# Altium schematic sheet Power_Supply.SchDoc
size A1
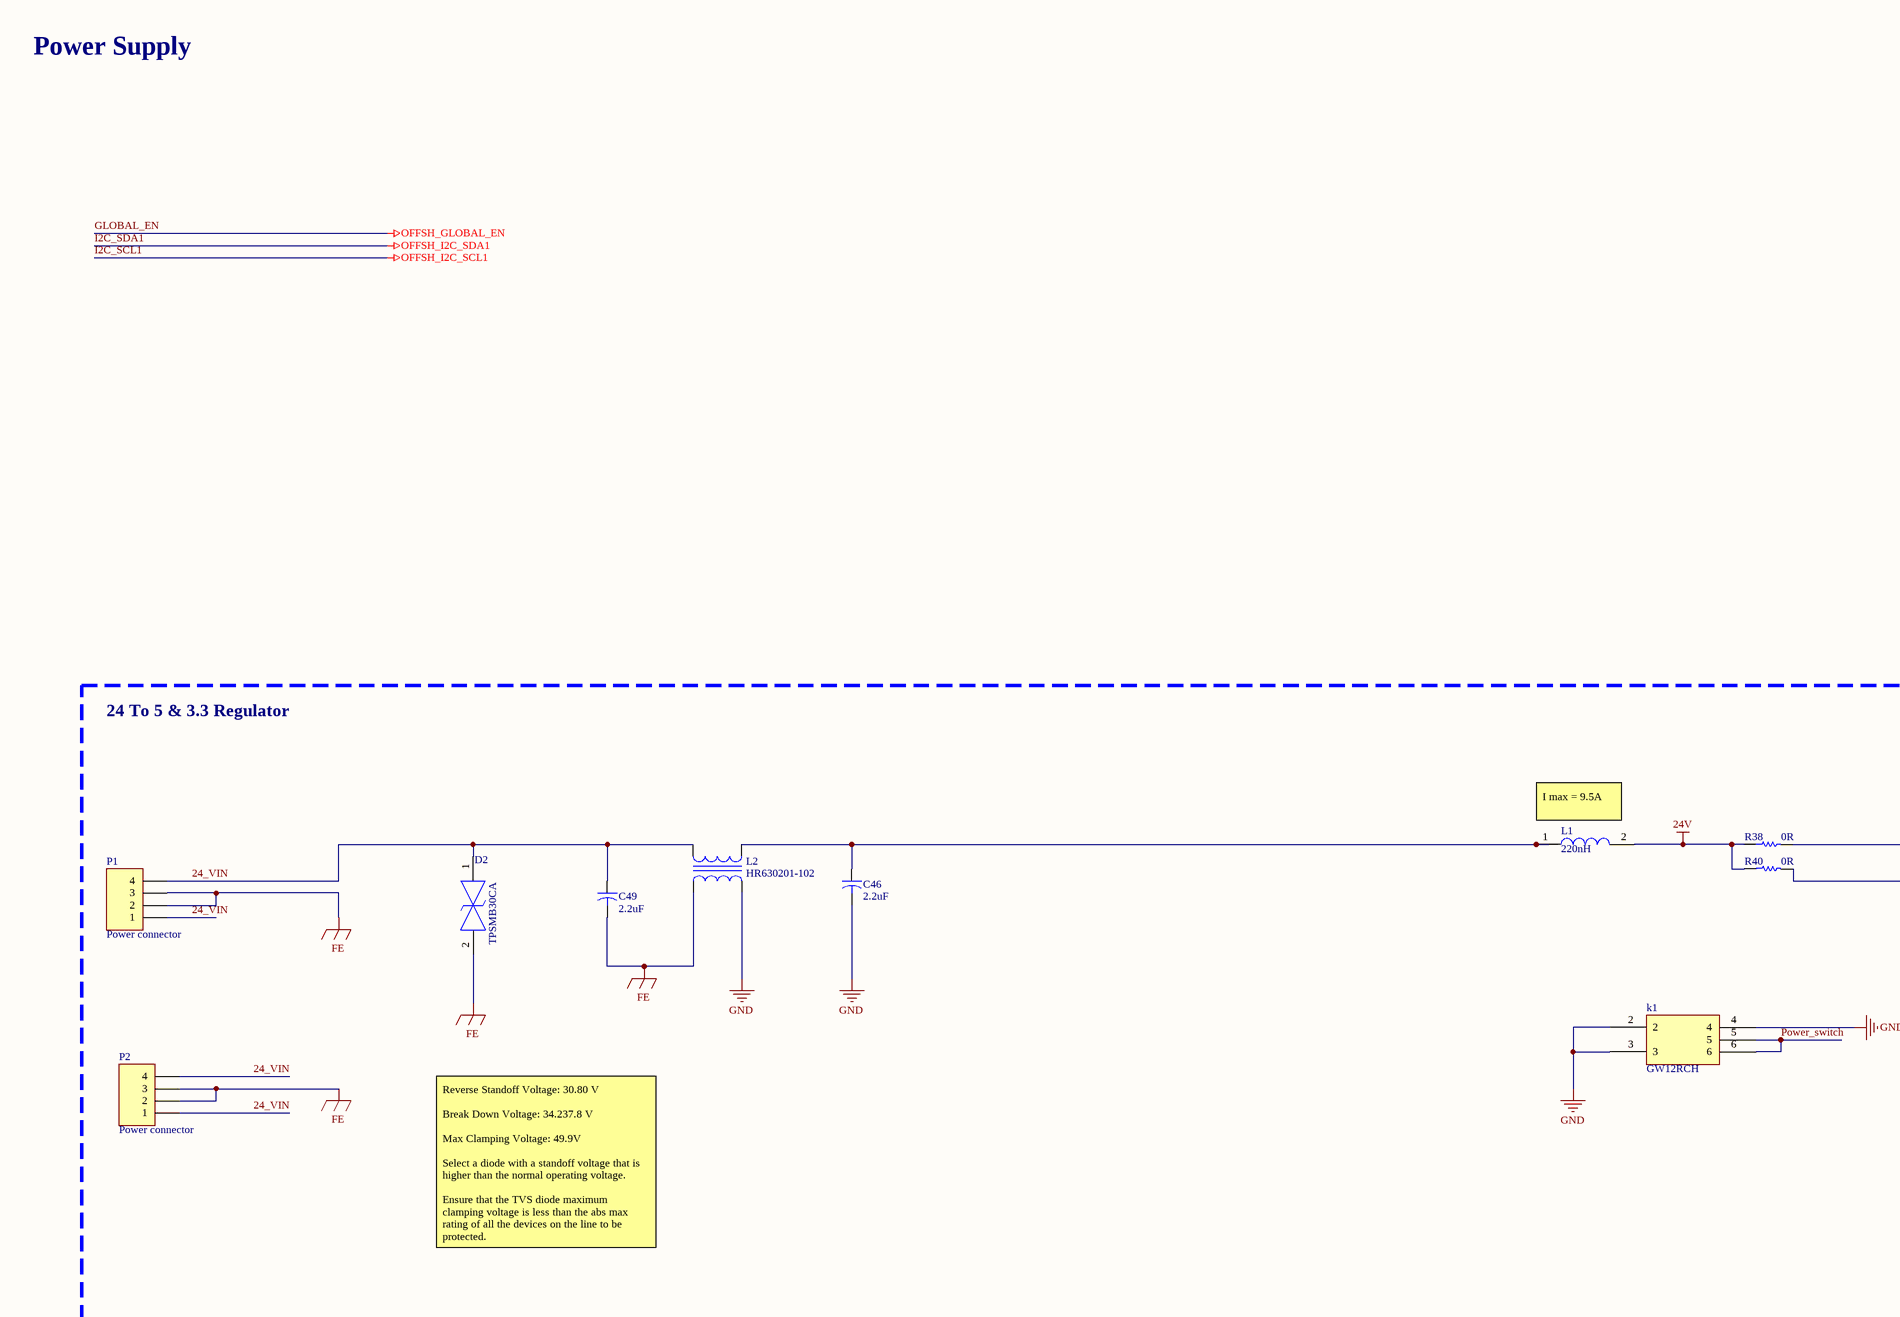
[diagram p0: Power_Supply.SchDoc, top left]
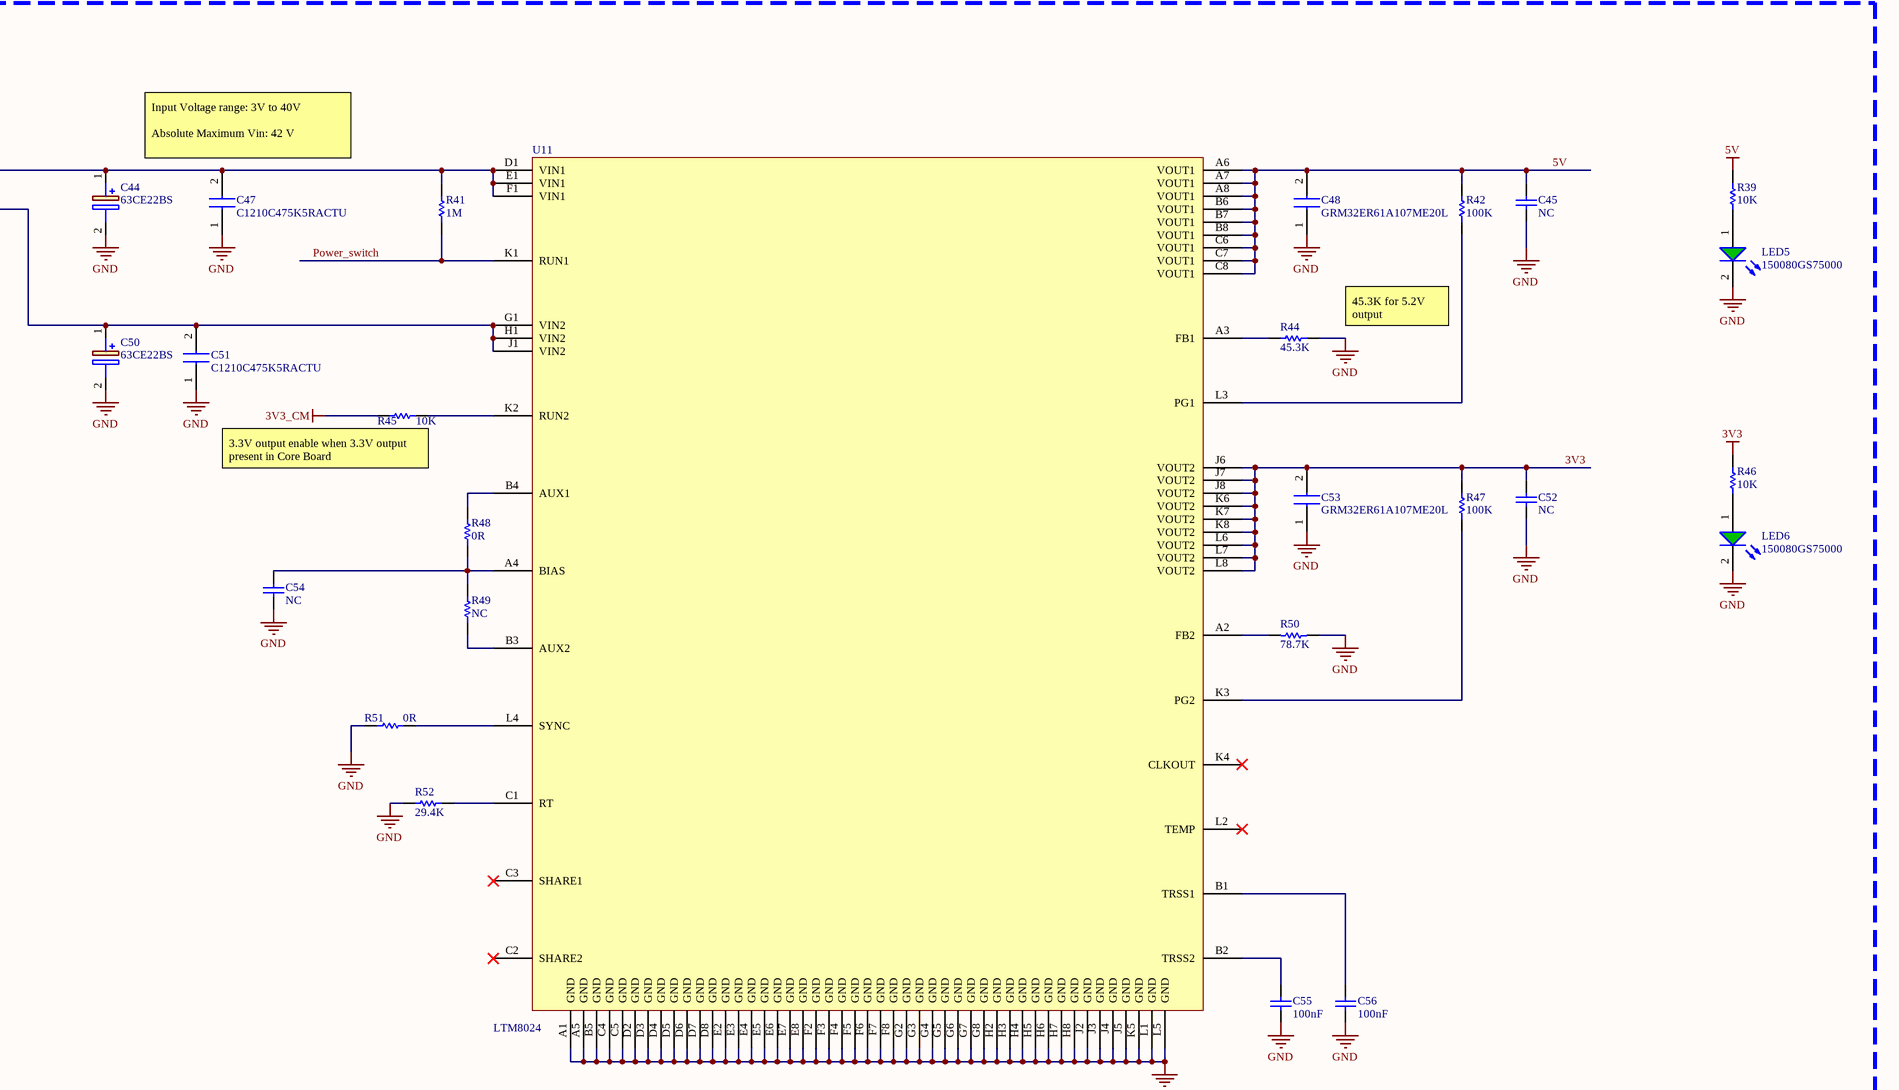
[diagram p1: Power_Supply.SchDoc, top right]
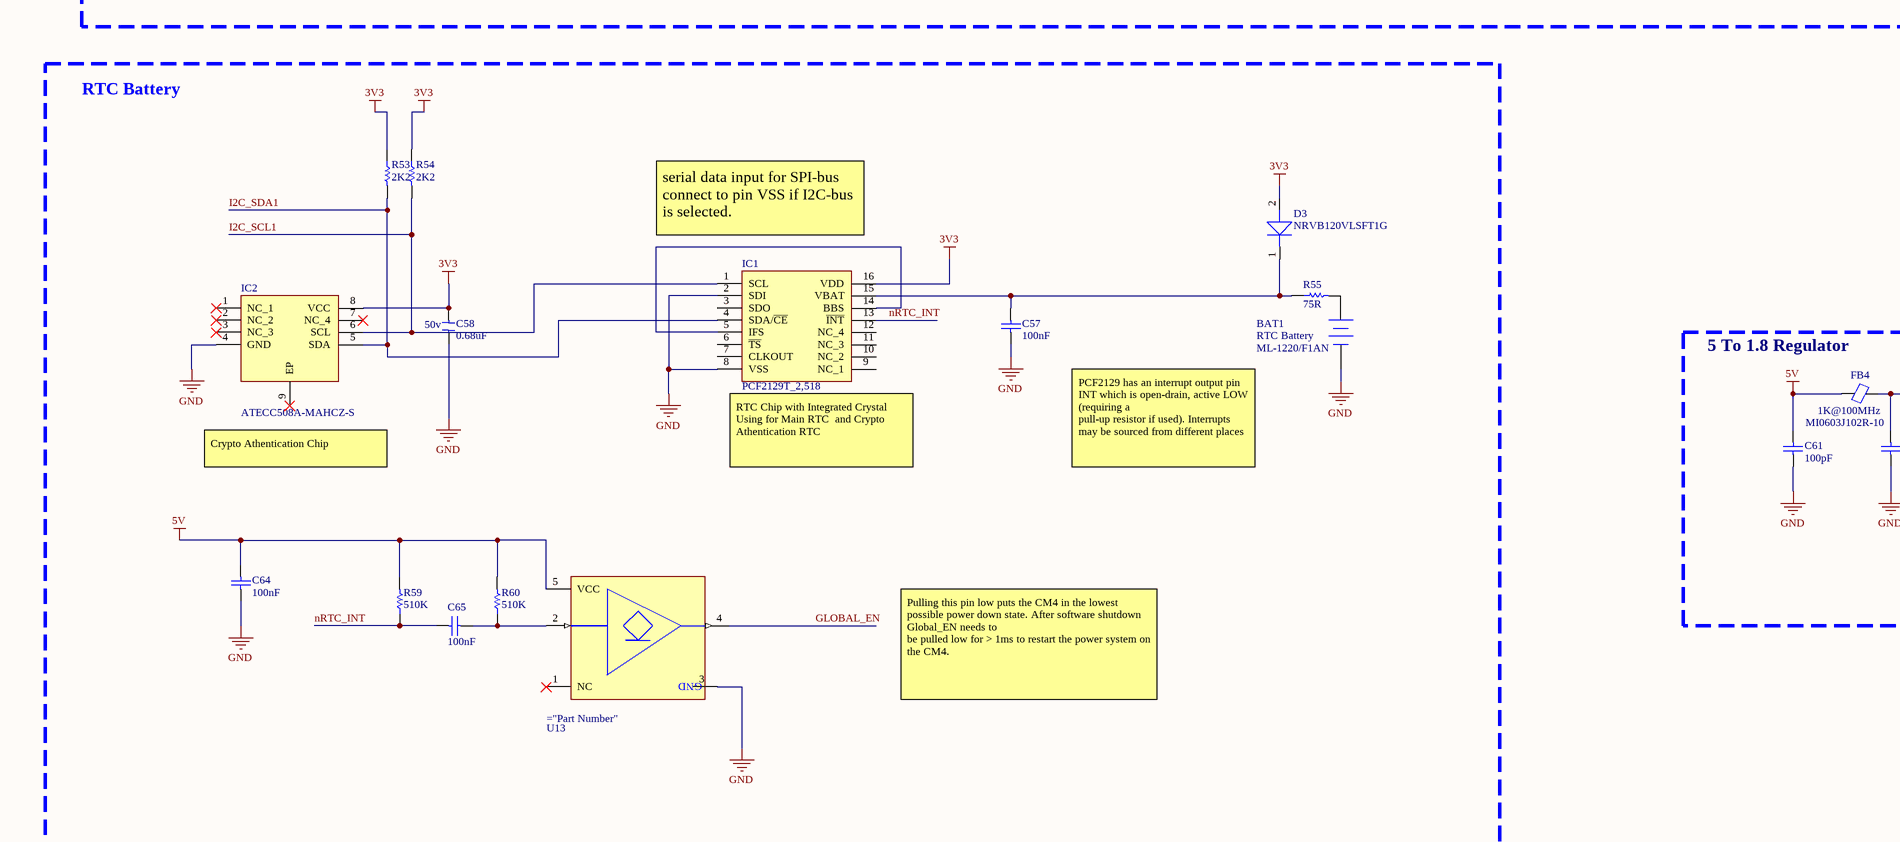
[diagram p2: Power_Supply.SchDoc, bottom left]
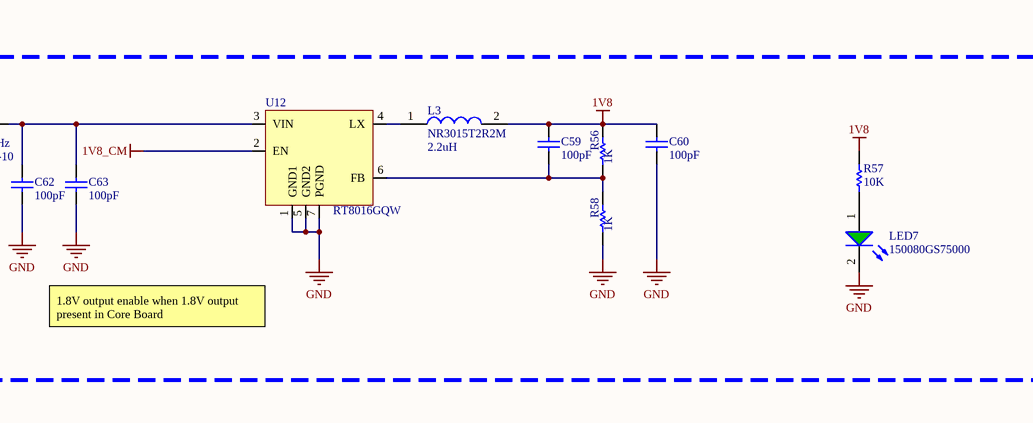
[diagram p3: Power_Supply.SchDoc, bottom right]

## Parts
BAT1  RTC Battery  Part Number: ML-1220/F1AN  [ML-1220F1AN]
C44  63CE22BS  [63CE22BS]
C45  value NC  [CAP (0603)]  (hidden comment: Cap)
C46  value 2.2uF  [TANTAL (SIZE B)]  (hidden comment: Cap_Tantal)
C47  C1210C475K5RACTU  [CAPC3225X280N]
C48  GRM32ER61A107ME20L  [CAPC3225X270N]
C49  value 2.2uF  [TANTAL (SIZE B)]  (hidden comment: Cap_Tantal)
C50  63CE22BS  [63CE22BS]
C51  C1210C475K5RACTU  [CAPC3225X280N]
C52  value NC  [CAP (0603)]  (hidden comment: Cap)
C53  GRM32ER61A107ME20L  [CAPC3225X270N]
C54  value NC  [CAP (0603)]  (hidden comment: Cap)
C55  value 100nF  [CAP (0603)]  (hidden comment: Cap)
C56  value 100nF  [CAP (0603)]  (hidden comment: Cap)
C57  value 100nF  [CAP (0603)]  (hidden comment: Cap)
C58  value 0.68uF  Voltage: 50v  [0603 Capacitor]  (hidden comment: Capacitor SMD)
C59  value 100pF  [CAP (0603)]  (hidden comment: Cap)
C60  value 100pF  [CAP (0603)]  (hidden comment: Cap)
C61  value 100pF  [CAP (0603)]  (hidden comment: Cap)
C62  value 100pF  [CAP (0603)]  (hidden comment: Cap)
C63  value 100pF  [CAP (0603)]  (hidden comment: Cap)
C64  value 100nF  [CAP (0603)]  (hidden comment: Cap)
C65  value 100nF  [CAP (0603)]  (hidden comment: Cap)
D2  TPSMB30CA  [DIONM5444X261N]
D3  Schottky Diode  [SODFL3616X98N (SOD-123FL)]  (value not drawn)
FB4  value 1K@100MHz  Part Number: MI0603J102R-10  [FB0603]  (hidden comment: Ferrite Bead)
IC1  PCF2129T_2,518  [SOIC127P1032X265-16N]
IC2  ATECC508A-MAHCZ-S  [DFN200X300X60-9N]
k1  GW12RCH  [PCBComponent_1]
L1  220nH  [WE-LHMI_402048]
L2  HR630201-102  [PCBComponent_1 - duplicate]
L3  value 2.2uH  [NR3015T2R2M]  (hidden comment: Inductor)
LED5  150080GS75000  [LED_0805_Green]
LED6  150080GS75000  [LED_0805_Green]
LED7  150080GS75000  [LED_0805_Green]
P1  Power connector  [XH_4Pin]
P2  Power connector  [XH_4Pin]
R38  value 0R  [RES (0603)]  (hidden comment: Res)
R39  value 10K  [R0603]  (hidden comment: Res)
R40  value 0R  [RES (0603)]  (hidden comment: Res)
R41  value 1M  [RES 0603]  (hidden comment: Res)
R42  value 100K  [RES (0603)]  (hidden comment: Res)
R44  value 45.3K  [RES (0603)]  (hidden comment: Res)
R45  value 10K  [RES (0603)]  (hidden comment: Res)
R46  value 10K  [R0603]  (hidden comment: Res)
R47  value 100K  [RES (0603)]  (hidden comment: Res)
R48  value 0R  [RES (0603)]  (hidden comment: Res)
R49  value NC  [RES (0603)]  (hidden comment: Res)
R50  value 78.7K  [RES (0603)]  (hidden comment: Res)
R51  value 0R  [RES (0603)]  (hidden comment: Res)
R52  value 29.4K  [RES (0603)]  (hidden comment: Res)
R53  value 2K2  [RES 0603]  (hidden comment: Res)
R54  value 2K2  [RES 0603]  (hidden comment: Res)
R55  value 75R  [RES (0603)]  (hidden comment: Res)
R56  value 1K  [R0603]  (hidden comment: Res)
R57  value 10K  [R0603]  (hidden comment: Res)
R58  value 1K  [R0603]  (hidden comment: Res)
R59  value 510K  [RES (0603)]  (hidden comment: Res)
R60  value 510K  [RES (0603)]  (hidden comment: Res)
U11  LTM8024  [BGA88C100P8X11_900X1125X352]
U12  RT8016GQW  [SON65P200X200X80-7N (WDFN-6L)]
U13  74LVC1G07SE-7  [SOT65P210X110-5N]  (value not drawn)

## Nets
1V8: C59.1 C60.1 L3.2 R56.2 R57.1
1V8_CM: U12.2(EN)
3V3: C52.1 C53.2 C58.2 D3.2(A) IC1.16(VDD) IC2.8(VCC) R46.1 R47.2 R53.1 R54.1 U11.J6(VOUT2) U11.J7(VOUT2) U11.J8(VOUT2) U11.K6(VOUT2) U11.K7(VOUT2) U11.K8(VOUT2) U11.L6(VOUT2) U11.L7(VOUT2) U11.L8(VOUT2)
3V3_CM: R45.2
5V: C45.1 C48.2 C61.1 C64.1 FB4.1 R39.1 R42.2 R59.2 R60.2 U11.A6(VOUT1) U11.A7(VOUT1) U11.A8(VOUT1) U11.B6(VOUT1) U11.B7(VOUT1) U11.B8(VOUT1) U11.C6(VOUT1) U11.C7(VOUT1) U11.C8(VOUT1) U13.5(VCC)
24V: L1.2 R38.1 R40.1
FE: C49.2 D2.2 L2.4 P1.2 P1.3 P2.2 P2.3
GLOBAL_EN: U13.4(Y)  [also labelled OFFSH_GLOBAL_EN]
GND: BAT1.2(-) C44.2(-) C45.2 C46.2 C47.1 C48.1 C50.2(-) C51.1 C52.2 C53.1 C54.1 C55.1 C56.1 C57.2 C58.1 C60.2 C61.2 C62.2 C63.2 C64.2 IC1.2(SDI) IC1.8(VSS) IC2.4(GND) k1.2 k1.3 k1.4 L2.2 LED5.2(C) LED6.2(C) LED7.2(C) R44.1 R50.1 R51.1 R52.2 R58.1 U11.A1(GND) U11.A5(GND) U11.B5(GND) U11.C4(GND) U11.C5(GND) U11.D2(GND) U11.D3(GND) U11.D4(GND) U11.D5(GND) U11.D6(GND) U11.D7(GND) U11.D8(GND) U11.E2(GND) U11.E3(GND) U11.E4(GND) U11.E5(GND) U11.E6(GND) U11.E7(GND) U11.E8(GND) U11.F2(GND) U11.F3(GND) U11.F4(GND) U11.F5(GND) U11.F6(GND) U11.F7(GND) U11.F8(GND) U11.G2(GND) U11.G3(GND) U11.G4(GND) U11.G5(GND) U11.G6(GND) U11.G7(GND) U11.G8(GND) U11.H2(GND) U11.H3(GND) U11.H4(GND) U11.H5(GND) U11.H6(GND) U11.H7(GND) U11.H8(GND) U11.J2(GND) U11.J3(GND) U11.J4(GND) U11.J5(GND) U11.K5(GND) U11.L1(GND) U11.L5(GND) U12.1(GND1) U12.5(GND2) U12.7(PGND)
I2C_SCL1: IC1.1(SCL) IC2.6(SCL) R54.2  [also labelled OFFSH_I2C_SCL1]
I2C_SDA1: IC1.4(SDA/~{CE}) IC2.5(SDA) R53.2  [also labelled OFFSH_I2C_SDA1]
24_VIN: C49.1 D2.1 L2.3 P1.1 P1.4 P2.1 P2.4
nRTC_INT: C65.2 IC1.13(~{INT}) R59.1
Power_switch: k1.5 k1.6 R41.1 U11.K1(RUN1)
NetBAT1_1: BAT1.1(+) R55.2
NetC44_1: C44.1(+) C47.2 R38.2 R41.2 U11.D1(VIN1) U11.E1(VIN1) U11.F1(VIN1)
NetC46_1: C46.1 L1.1 L2.1
NetC50_1: C50.1(+) C51.2 R40.2 U11.G1(VIN2) U11.H1(VIN2) U11.J1(VIN2)
NetC54_2: C54.2 R48.1 R49.2 U11.A4(BIAS)
NetC55_2: C55.2 U11.B2(TRSS2)
NetC56_2: C56.2 U11.B1(TRSS1)
NetC57_1: C57.1 D3.1(K) IC1.15(VBAT) R55.1
NetC59_2: C59.2 R56.1 R58.2 U12.6(FB)
NetC62_1: C62.1 C63.1 FB4.2 U12.3(VIN)
NetC65_1: C65.1 R60.1 U13.2(A)
NetIC1_5: IC1.5(IFS) IC1.14(BBS)
NetL3_1: L3.1 U12.4(LX)
NetLED5_1: LED5.1(A) R39.2
NetLED6_1: LED6.1(A) R46.2
NetLED7_1: LED7.1(A) R57.2
NetR42_1: R42.1 U11.L3(PG1)
NetR44_2: R44.2 U11.A3(FB1)
NetR45_1: R45.1 U11.K2(RUN2)
NetR47_1: R47.1 U11.K3(PG2)
NetR48_2: R48.2 U11.B4(AUX1)
NetR49_1: R49.1 U11.B3(AUX2)
NetR50_2: R50.2 U11.A2(FB2)
NetR51_2: R51.2 U11.L4(SYNC)
NetR52_1: R52.1 U11.C1(RT)

Not connected (* = marked no-connect by the designer): IC1 3(SDO) 6(~{TS}) 7(CLKOUT) 9(NC_1) 10(NC_2) 11(NC_3) 12(NC_4); IC2 1(NC_1)* 2(NC_2)* 3(NC_3)* 7(NC_4)* 9(EP)*; U11 C2(SHARE2)* C3(SHARE1)* K4(CLKOUT)* L2(TEMP)*; U13 1(NC)* 3(GND)

## Notes on the sheet
- Power Supply
- 24 To 5 & 3.3 Regulator
- (near L1) I max = 9.5A
- Input Voltage range: 3V to 40V
  Absolute Maximum Vin: 42 V
- (near R44) 45.3K for 5.2V output
- (near R45) 3.3V output enable when 3.3V output present in Core Board
- Reverse Standoff Voltage: 30.80 V
  Break Down Voltage: 34.237.8 V
  Max Clamping Voltage: 49.9V
  Select a diode with a standoff voltage that is higher than the normal operating voltage.
  Ensure that the TVS diode maximum clamping voltage is less than the abs max rating of all the devices on the line to be protected.
- RTC Battery
- serial data input for SPI-bus
  connect to pin VSS if I2C-bus is selected.
- (near FB4) 5 To 1.8 Regulator
- Crypto Athentication Chip
- (near IC1) RTC Chip with Integrated Crystal
  Using for Main RTC  and Crypto Athentication RTC
- PCF2129 has an interrupt output pin INT which is open-drain, active LOW (requiring a
  pull-up resistor if used). Interrupts may be sourced from different places
- 1.8V output enable when 1.8V output present in Core Board
- Pulling this pin low puts the CM4 in the lowest possible power down state. After software shutdown Global_EN needs to
  be pulled low for > 1ms to restart the power system on the CM4.

## Library data of the parts
BAT1 = RTC BAT (ML-1220_F1AN): Manufacturer_Name: Panasonic Battery; Datasheet Link: http://media.digikey.com/pdf/Data%20Sheets/Panasonic%20Inustrial/ML_Serie.pdf; Link: https://www.digikey.com/product-detail/en/panasonic-bsg/ML-1220-F1AN/P295-ND/447504
C44 C50 = 63CE22BS: Capacitor Polarised; Manufacturer_Name: Suncon; Value: 22uF; Datasheet Link: http://www.sunelec.co.jp/common/pdf/eng/CE-BS.pdf; Height: 8mm; Manufacturer_Part_Number: 63CE22BS; Arrow Part Number: 63CE22BS
C45 C52 C54 = Cap: SMD capacitor; Part Number: SMD CAP (0603)
C46 C49 = Cap_Tantal: Tantalum Capacitor; Voltage: 10V
C47 C51 = C1210C475K5RACTU: Capacitor, 4.7uF, 50V; Manufacturer_Name: Kemet; Datasheet Link: https://componentsearchengine.com/Datasheets/2/C1210C475K5RACTU.pdf; Height: 2.8mm; Manufacturer_Part_Number: C1210C475K5RACTU; Arrow Part Number: C1210C475K5RACTU; Arrow Price/Stock: https://www.arrow.com/en/products/c1210c475k5ractu/kemet-corporation; Mouser Part Number: 80-C1210C475K5R; Mouser Price/Stock: https://www.mouser.co.uk/ProductDetail/KEMET/C1210C475K5RACTU?qs=dB0LedT%252BmmBpncka1nOCUg%3D%3D; Value: 4.7uF; Voltage: 50V; Package: 1210
C48 C53 = GRM32ER61A107ME20L: Capacitor, 100uF, 10V; Manufacturer_Name: Murata Electronics; Datasheet Link: https://psearch.en.murata.com/capacitor/product/%23.html; Height: 2.7mm; Manufacturer_Part_Number: GRM32ER61A107ME20L; Arrow Part Number: GRM32ER61A107ME20L; Arrow Price/Stock: https://www.arrow.com/en/products/grm32er61a107me20l/murata-manufacturing; Mouser Part Number: 81-GRM32ER61A107ME0L; Mouser Price/Stock: https://www.mouser.co.uk/ProductDetail/Murata-Electronics/GRM32ER61A107ME20L?qs=QRVci0nWsCb7NlWFDLlBHA%3D%3D; Value: 100uF
C55-C57 C61-C65 = Cap: SMD capacitor; Part Number: SMD CAP (0603); Voltage: 50V
C59 C60 = Cap: SMD capacitor; Voltage: 50V
D2 = TPSMB62CA: Partnumber : TPSMB110CA; Manufacturer_Part_Number: TPSMB110CA
D3 = NRVB120VLSFT1G: Manufacturer_Name: ON Semiconductor; Datasheet Link: http://www.onsemi.com/pub/Collateral/MBR120VLSFT1-D.PDF; Height: 0.98mm; Link: https://www.digikey.com/product-detail/en/on-semiconductor/NRVB120VLSFT1G/NRVB120VLSFT1GOSCT-ND/8538727; Part Number: NRVB120VLSFT1G
FB4 = Ferrite Bead: Ferrite Bead SMD; Link: https://www.digikey.com/product-detail/en/laird-signal-integrity-products/MI0805J102R-10/240-2551-1-ND/1015989
IC1 = PCF2129T_2,518: Integrated Circuit; Manufacturer_Name: NXP; Manufacturer_Part_Number: PCF2129T/2,518; Datasheet Link: http://www.nxp.com/docs/en/data-sheet/PCF2129.pdf; Height: 2.65mm; Mouser Part Number: 771-PCF2129T/2,518; Mouser Price/Stock: https://www.mouser.co.uk/ProductDetail/NXP-Semiconductors/PCF2129T-2518/?qs=O0BhuZj9Wkzo98h9NloC7Q%3D%3D; Arrow Part Number: PCF2129T/2,518; Arrow Price/Stock: https://www.arrow.com/en/products/pcf2129t2518/nxp-semiconductors
IC2 = ATECC508A-MAHCZ-S: Integrated Circuit; Manufacturer_Name: Microchip; Datasheet Link: http://www.mouser.com/ds/2/268/Atmel-8923S-CryptoAuth-ATECC508A-Datasheet-Summary-1065793.pdf; Height: 0.6mm; Manufacturer_Part_Number: ATECC508A-MAHCZ-S; Mouser Part Number: 556-ATECC508AMAHCZS; Mouser Price/Stock: https://www.mouser.co.uk/ProductDetail/Microchip-Technology-Atmel/ATECC508A-MAHCZ-S?qs=%2FPOkb%252BiDxRUOydmISUnqmg%3D%3D; Arrow Part Number: ATECC508A-MAHCZ-S; Arrow Price/Stock: https://www.arrow.com/en/products/atecc508a-mahcz-s/microchip-technology
L1 = 744373240022: Manufacturer_Name: Wurth Elektronik; Datasheet Link: http://componentsearchengine.com/Datasheets/1/744373240022.pdf; Manufacturer_Part_Number: 744373240022; Arrow Part Number: 744373240022; Mouser Part Number: 710-744373240022; Mouser Price/Stock: https://www.mouser.co.uk/ProductDetail/Wurth-Elektronik/744373240022?qs=cFlH0mFHHFrAuUoRjqUUNw%3D%3D; Part Number: 744373240022
L2 = TRANS1
L3 = NR3015T2R2M: Manufacturer_Name: TAIYO YUDEN; Datasheet Link: http://ds.yuden.co.jp/TYCOMPAS/ut/detail.do?productNo=NR3015T2R2M&fileName=NR3015T2R2M_SS&mode=specSheetDownload; Link: https://www.digikey.com/product-detail/en/taiyo-yuden/NR3015T2R2M/587-1648-1-ND/1008263; Part Number: NR3015T2R2M
LED5-LED7 = WL-SMCW 0805  150080GS75000: SMD mono-color Chip LED, WL-SMCW, Green; Manufacturer: W黵th Elektronik eiSos GmbH; PartNo: 150080GS75000; ComponentLink1Description: Manufacturer; ComponentLink1URL: http://www.we-online.de; Created by: Christin Otto; Created Date: June 2013; ComponentLink2Description: Datasheet; ComponentLink2URL: http://katalog.we-online.com/led/datasheet/150080GS75000.pdf; Color: Green
P1 P2 = Header 4: CONN HEADER VERT 4POS 2.5MM JST Sales America Inc., B4B-XH-AM(LF)(SN); LatestRevisionDate: 17-Jul-2002; LatestRevisionNote: Re-released for DXP Platform.; Publisher: Altium Limited; Part Number: B4B-XH-AM(LF)(SN)
R38 R40-R42 R44 R45 R47-R55 = Res: SMD resistor; Tolerance: 5%
R39 R46 R56-R58 = Res: Resistor; Published: 8-Jun-2000; LatestRevisionDate: 17-Jul-2002; LatestRevisionNote: Re-released for DXP Platform.; PackageReference: AXIAL-0.3; Publisher: Altium Limited
R59 R60 = Res: SMD resistor; Tolerance: 1%
U12 = RT8016GQW: Step-Down Converter; Manufacturer_Name: RICHTEK; Datasheet Link: https://componentsearchengine.com/Datasheets/2/RT8010GQW.pdf; Height: 0.8mm; Link: https://www.digikey.com/product-detail/en/richtek-usa-inc/RT8016GQW/1028-1031-1-ND/3071294; Part Number: RT8016GQW